# EasyEDA Pro project ProPrj_TPA3156_EASYEDA.epro, board PCB1
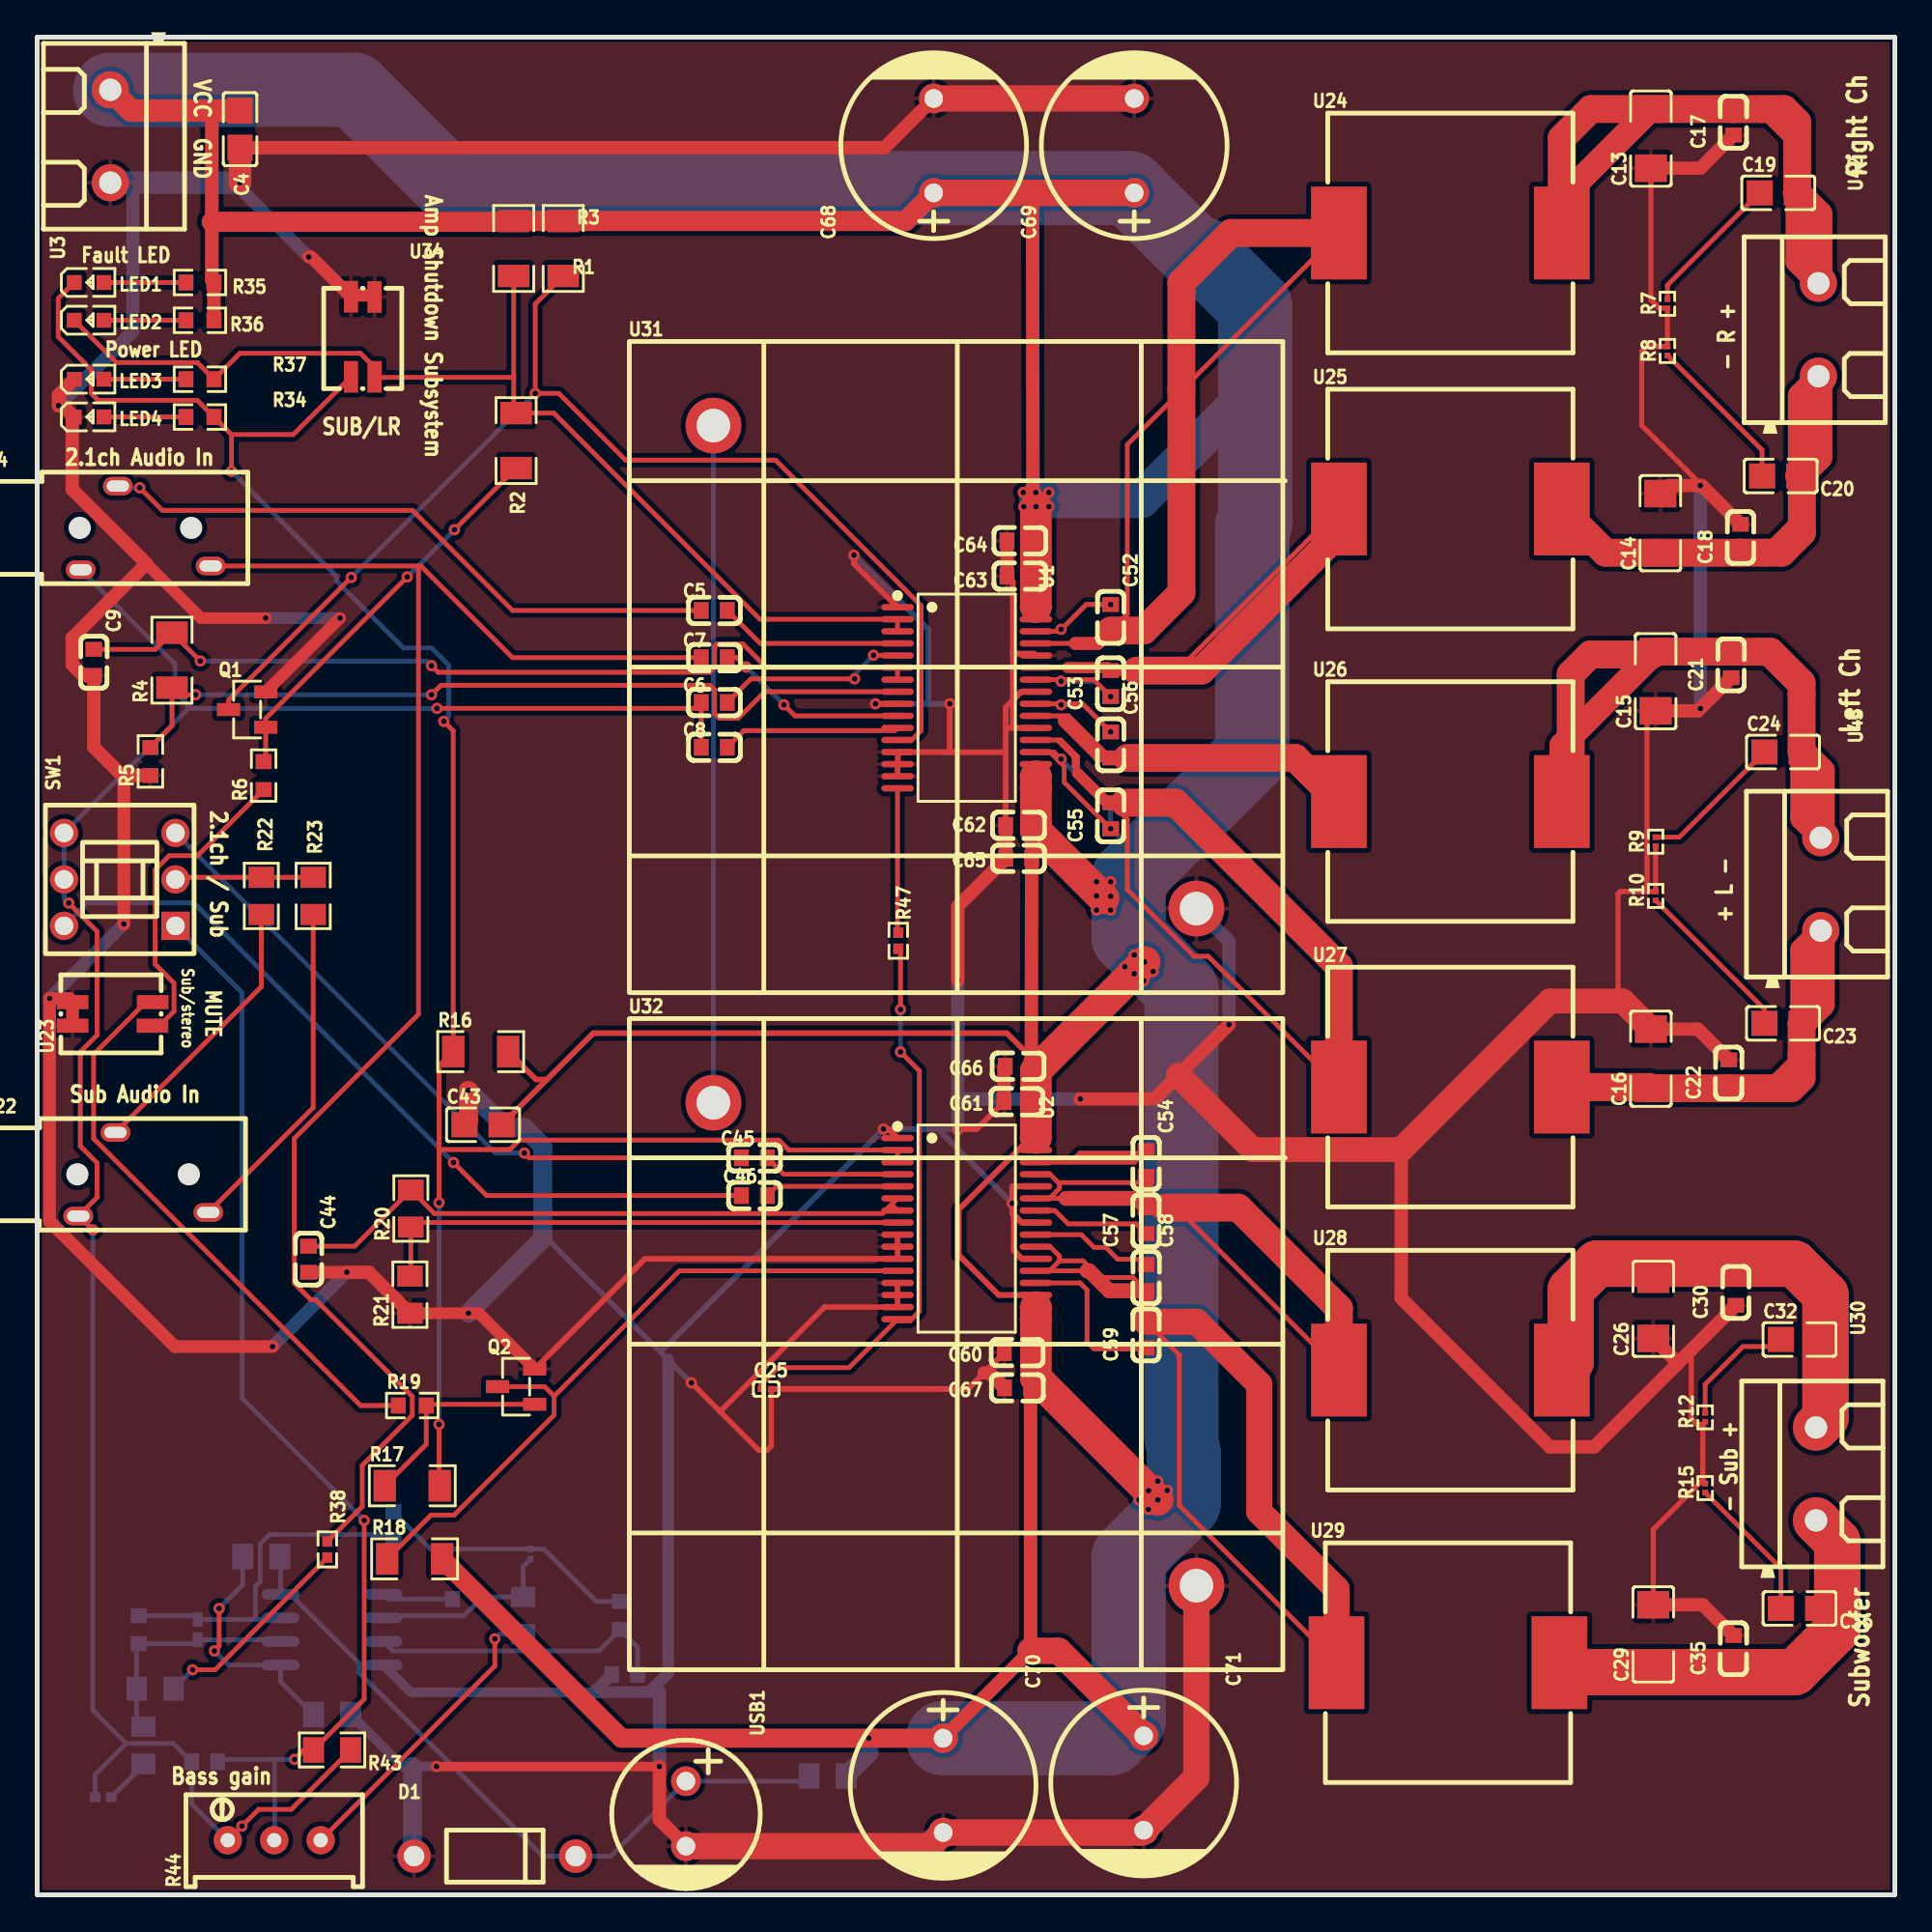
[diagram p1: board, top side]
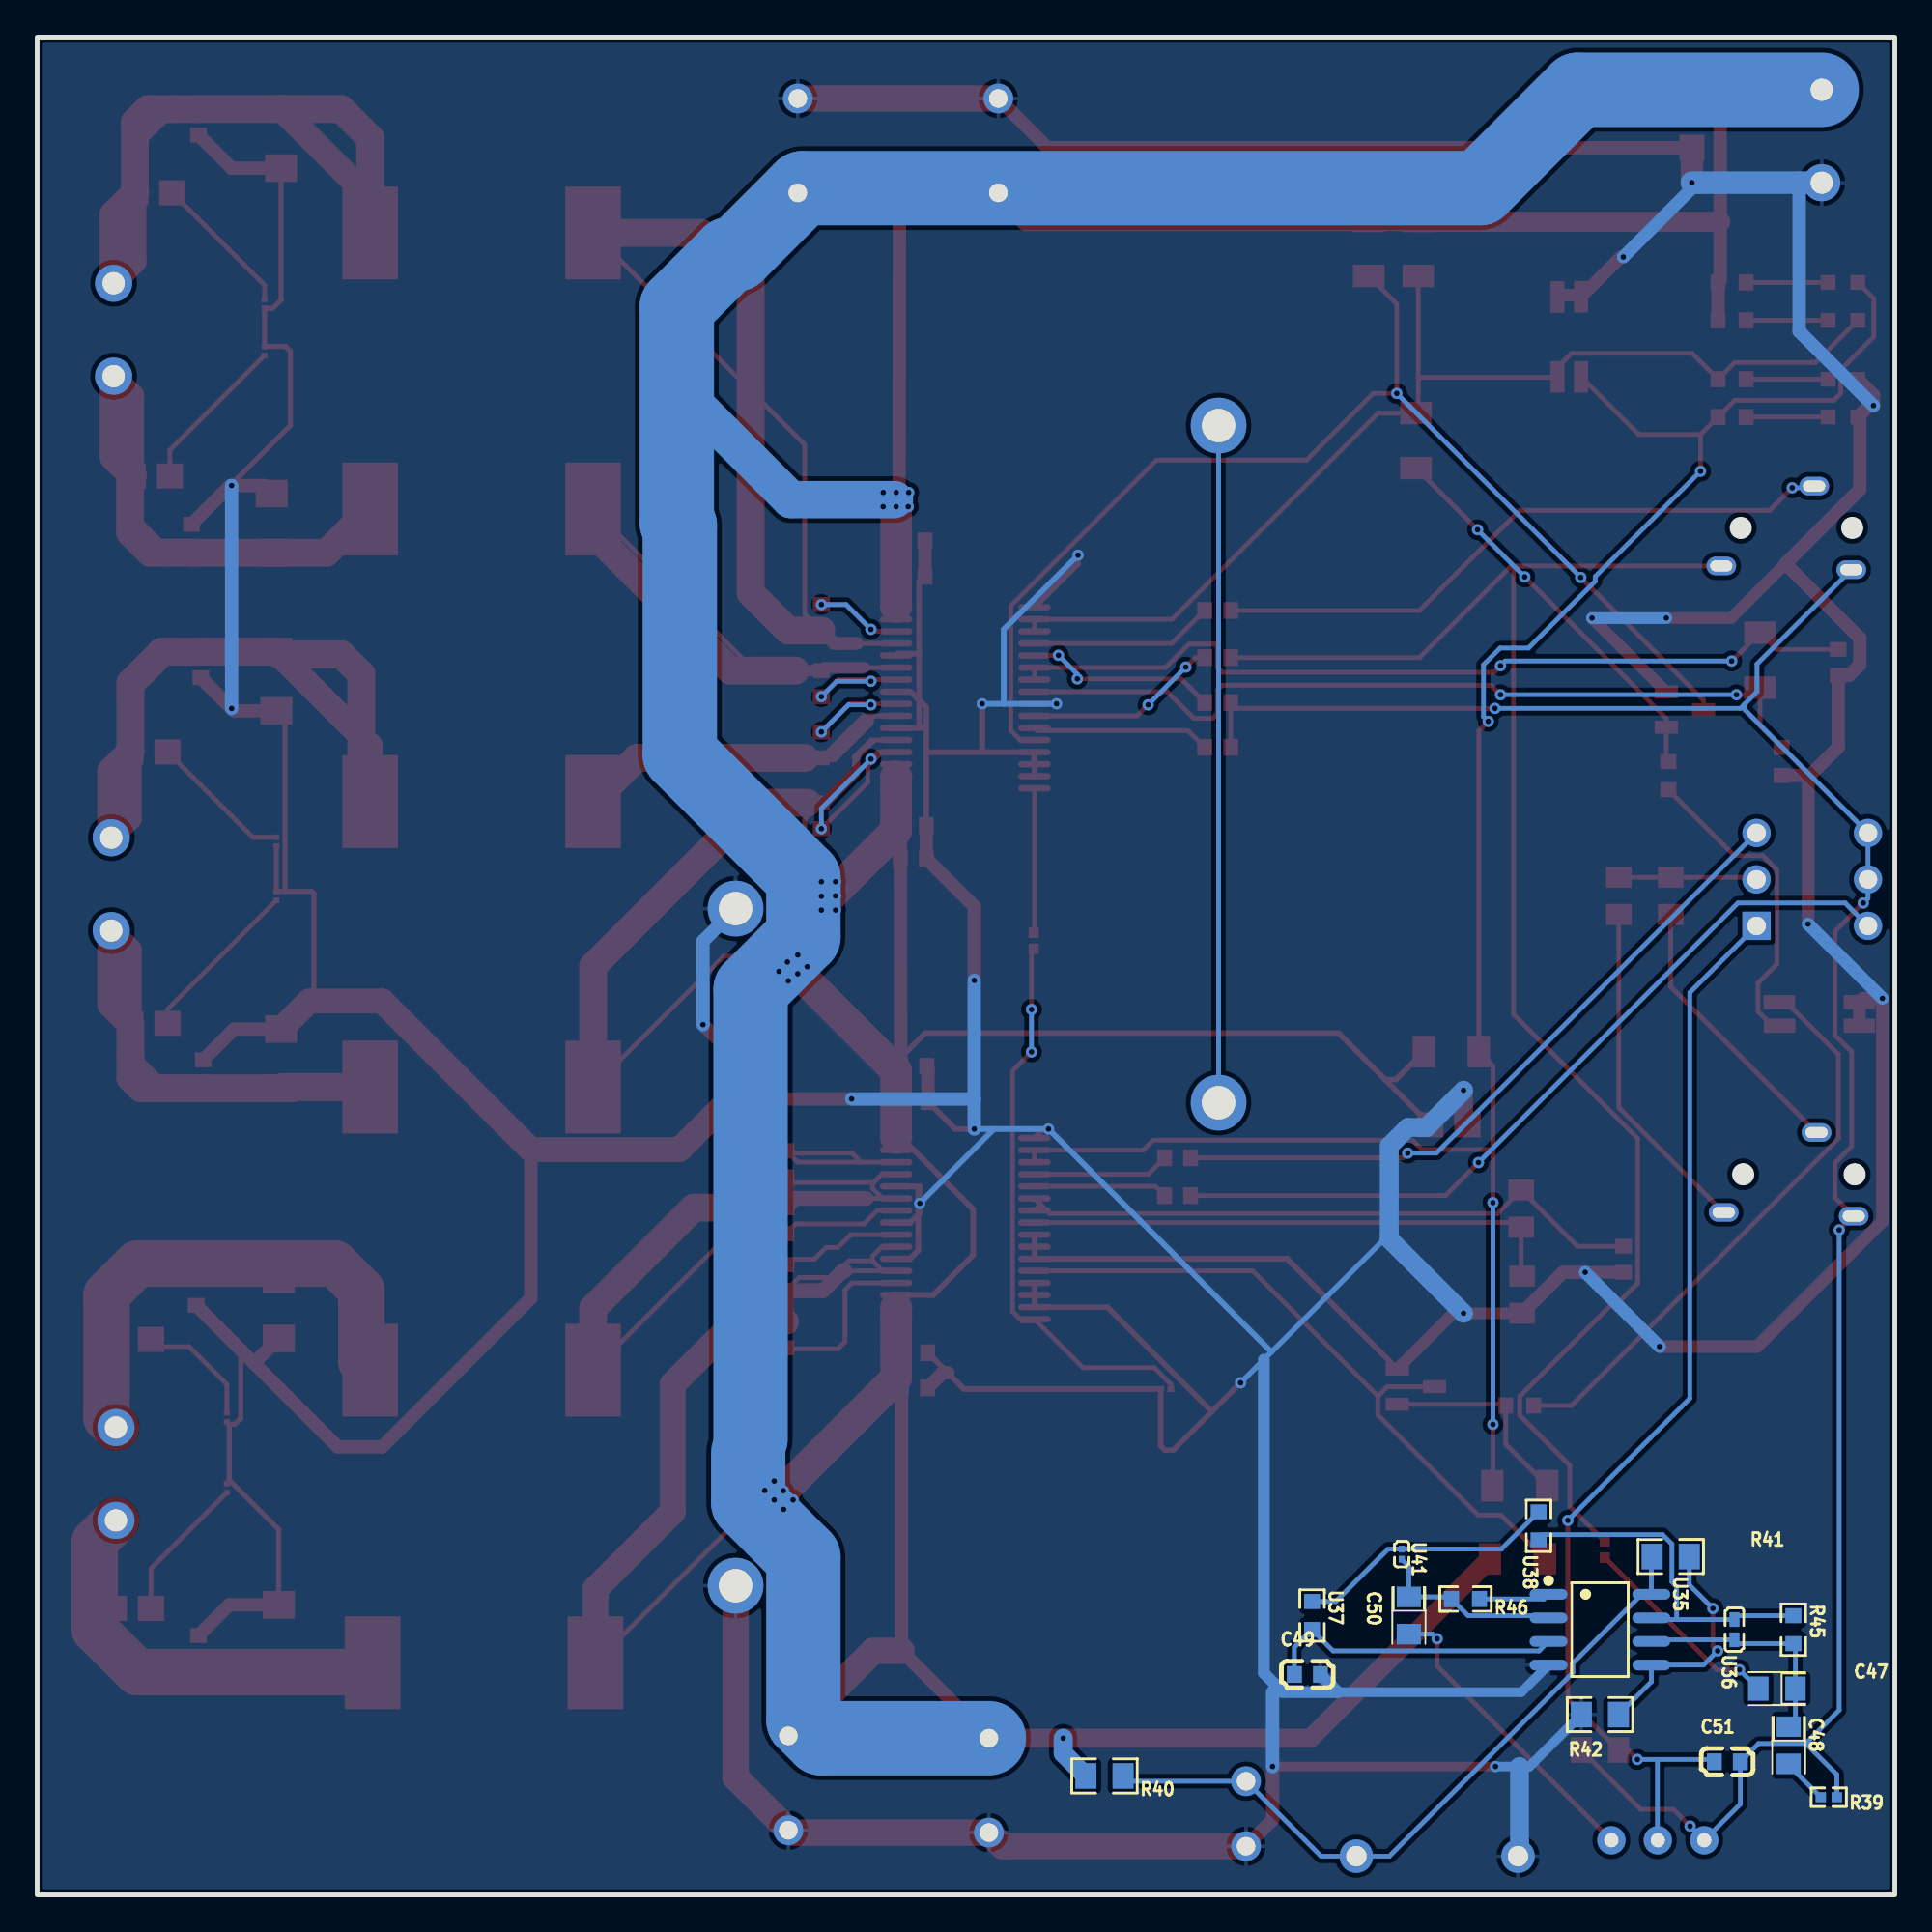
[diagram p2: board, bottom side, seen from below]

Outline 100 x 100 mm; copper layers: Top Layer, Bottom Layer. Coordinates in mm from the lower left corner of the outline.
Outline path: rectangle 0,100 100,0
Stack: Top Layer 0.035mm / Dielectric1 1.51mm FR4 er 4.5 / Bottom Layer 0.035mm

## Design rules (mm)
template: Custom Config
spacing copperThickness1oz (default): track to track 0.102, other pairs 0.152 to 0.3
spacing copperThickness2oz: track to track 0.203, other pairs 0.152 to 0.3
track width copperThickness2oz (default): min 0.203, default 0.254, max 2.54
track width PVCC: min 0.254, default 4, max 5.23
track width Audio_OUT_75W: min 0.4, default 3, max 3.4
track width AUDIO_OUT_140W: min 0.4, default 1.2, max 2.54
differential pair differentialPair (default): width min 0.127, default 0.254, max 2.54; gap min 0.152, default 0.152
via viaSize (default): diameter min 0.5, default 0.61, max 10; hole min 0.3, default 0.305, max 6.3
net PVCC uses PVCC
net GND uses PVCC
net OUT_R+ uses Audio_OUT_75W
net OUT_R- uses Audio_OUT_75W
net OUT_L- uses Audio_OUT_75W
net OUT_L+ uses Audio_OUT_75W
net AUDIO_SUBW+ uses AUDIO_OUT_140W
net AUDIO_SUBW- uses AUDIO_OUT_140W

## Placement (name value [footprint] x y rotation side)
C4  10nF  [C0805]  10.92 95.05 90 top
C5  100nF  [C0603]  36.45 69.14 180 top
C6  100nF  [C0603]  36.45 64.19 180 top
C7  100nF  [C0603]  36.45 66.6 180 top
C8  100nF  [C0603]  36.45 61.77 180 top
C9  1uF  [C0603]  3.05 66.34 270 top
C13  680nF  [C1206]  86.87 94.54 90 top
C14  680nF  [C1206]  87.38 73.84 90 top
C15  680nF  [C1206]  87.12 65.33 90 top
C16  680nF  [C1206]  86.87 45.01 90 top
C17  1nF  [C0603]  91.31 95.43 90 top
C18  1nF  [C0603]  91.69 73.08 90 top
C19  10nF  [C0805]  93.73 91.62 0 top
C20  10nF  [C0805]  93.85 76.38 180 top
C21  1nF  [C0603]  91.19 66.22 90 top
C22  1nF  [C0603]  91.06 44.25 90 top
C23  10nF  [C0805]  93.98 46.91 180 top
C24  10nF  [C0805]  93.98 61.52 0 top
C25  47pF  [C0201]  39.24 27.23 0 top
C26  680nF  [C1206]  87 31.55 90 top
C29  680nF  [C1206]  87 14.02 90 top
C30  1nF  [C0603]  91.44 32.44 90 top
C32  10nF  [C0805]  94.87 29.9 0 top
C35  1nF  [C0603]  91.31 13.26 90 top
C36  10nF  [C0805]  94.87 15.42 180 top
C43  10nF  [C0805]  24 41.45 0 top
C44  1uF  [C0603]  14.61 34.21 270 top
C45  100nF  [C0603]  38.61 39.67 180 top
C46  100nF  [C0603]  38.61 37.64 180 top
C47  10uF  [CAP-SMD_L2.0-W1.3-FD]  6.35 11.1 0 bottom
C48  10uF  [CAP-SMD_L2.0-W1.3-FD]  5.72 8.05 270 bottom
C49  100nF  [C0603]  31.62 11.86 180 bottom
C50  10uF  [CAP-SMD_L2.0-W1.3-FD]  26.16 15.04 270 bottom
C51  100nF  [C0603]  9.02 7.16 180 bottom
C52  220nF  [C0603]  57.78 68.76 270 top
C53  220nF  [C0603]  57.78 65.2 90 top
C54  220nF  [C0603]  59.69 39.36 270 top
C55  220nF  [C0603]  57.78 58.09 90 top
C56  220nF  [C0603]  57.78 61.9 270 top
C57  220nF  [C0603]  59.69 36.29 90 top
C58  220nF  [C0603]  59.69 33.22 270 top
C59  220nF  [C0603]  59.69 30.15 90 top
C60  100nF  [C0603]  52.76 29.19 0 top
C61  100nF  [C0603]  52.75 42.69 0 top
C62  100nF  [C0603]  52.84 57.57 0 top
C63  100nF  [C0603]  52.91 70.98 0 top
C64  1nF  [C0603]  52.91 72.89 0 top
C65  1nF  [C0603]  52.84 55.79 0 top
C66  1nF  [C0603]  52.81 44.6 0 top
C67  1nF  [C0603]  52.77 27.29 0 top
C68  220uF  [CAP-TH_BD10.0-P5.00-D1.0-FD]  48.26 94.16 90 top
C69  220uF  [CAP-TH_BD10.0-P5.00-D1.0-FD]  59.06 94.16 90 top
C70  220uF  [CAP-TH_BD10.0-P5.00-D1.0-FD]  48.77 5.89 270 top
C71  220uF  [CAP-TH_BD10.0-P5.00-D1.0-FD]  59.56 6.02 270 top
D1  1N4742  [DO-41_BD2.4-L4.7-P8.70-D0.8-FD]  24.64 2.08 0 top
LED1  KT-0603R  [LED0603-RD]  2.79 86.79 0 top
LED2  KT-0603R  [LED0603-RD]  2.79 84.76 0 top
LED3  19-213/Y2C-CQ2R2L/3T(CY)  [LED0603-RD-YELLOW]  2.79 81.58 0 top
LED4  19-213/Y2C-CQ2R2L/3T(CY)  [LED0603-RD-YELLOW]  2.79 79.55 0 top
Q1  MMBT2222A 1P  [SOT-23-3_L2.9-W1.3-P1.90-LS2.4-BR]  11.3 63.81 0 top
Q2  MMBT2222A 1P  [SOT-23-3_L2.9-W1.3-P1.90-LS2.4-BR]  25.78 27.36 0 top
R1  100kΩ  [R1206]  25.65 88.63 90 top
R2  100kΩ  [R1206]  25.78 78.28 90 top
R3  100kΩ  [R1206]  28.32 88.63 90 top
R4  100kΩ  [R1206]  7.26 66.46 90 top
R5  20kΩ  [R0603]  6.1 61.01 90 top
R6  1k  [R0603]  12.19 60.25 90 top
R7  3.32Ω  [R0201]  87.76 85.65 90 top
R8  3.32Ω  [R0201]  87.76 83.11 90 top
R9  3.32Ω  [R0201]  87.12 56.69 90 top
R10  3.32Ω  [R0201]  87.12 53.77 90 top
R12  3.32Ω  [R0201]  89.79 25.71 90 top
R15  3.32Ω  [R0201]  89.79 21.9 90 top
R16  100kΩ  [R1206]  23.88 45.39 0 top
R17  100kΩ  [R1206]  20.19 22.02 0 top
R18  100kΩ  [R1206]  20.32 18.09 0 top
R19  1k  [R0603]  20.19 26.34 0 top
R20  47kΩ  [R0805]  20.12 36.94 90 top
R21  75kΩ  [R0805]  20.07 32.31 90 top
R22  220Ω  [R0805]  12.06 53.77 90 top
R23  220Ω  [R0805]  14.86 53.77 90 top
R34  1.1kΩ  [R0603]  8.76 79.55 180 top
R35  1.1kΩ  [R0603]  8.76 86.79 0 top
R36  1.1kΩ  [R0603]  8.76 84.76 0 top
R37  1.1kΩ  [R0603]  8.76 81.58 180 top
R38  15kΩ  [R0402]  15.62 18.59 270 top
R39  15kΩ  [R0402]  3.56 5.26 0 bottom
R40  2kΩ  [R0805]  42.54 6.4 0 bottom
R41  100kΩ  [R0805]  12.06 18.21 0 bottom
R42  100kΩ  [R0805]  15.88 9.7 180 bottom
R43  100kΩ  [R0805]  15.88 7.8 180 top
R44  50kΩ  [RES-ADJ-TH_3P-L9.5-W4.85-P2.50-BL-BS]  12.76 2.94 90 top
R45  47kΩ  [R0603]  5.46 14.28 270 bottom
R46  1k  [R0603]  23.11 15.93 0 bottom
R47  4.7kΩ  [R0402]  46.35 51.36 270 top
SW1  KFC8080-Z  [SW-TH_6P-L8.0-W8.0-P2.50]  4.44 54.66 90 top
U1  TPA3156D2DADR  [HTSSOP-32_L11.0-W6.1-P0.65-LS8.1-BL]  50.04 64.44 270 top
U2  TPA3156D2DADR  [HTSSOP-32_L11.0-W6.1-P0.65-LS8.1-BL]  50.04 35.86 270 top
U3  XY301V-A-5.0-2P  [CONN-TH_XY301V-A-5.0-2P]  3.94 94.67 90 top
U4  HC-PJ-320A-3P-D  [AUDIO-TH_HC-PJ-320A-3P-D]  5.84 73.58 0 top
U22  HC-PJ-320A-3P-D  [AUDIO-TH_HC-PJ-320A-3P-D]  5.72 38.79 0 top
U23  TU-02  [SW-SMD_4P-P1.27-L4.2-W5.4]  4.06 47.42 90 top
U24  10uH  [IND-SMD_L13.2-W12.9_MMD-12FD]  76.07 89.46 0 top
U25  10uH  [IND-SMD_L13.2-W12.9_MMD-12FD]  76.07 74.6 0 top
U26  10uH  [IND-SMD_L13.2-W12.9_MMD-12FD]  76.07 58.85 0 top
U27  10uH  [IND-SMD_L13.2-W12.9_MMD-12FD]  76.07 43.48 0 top
U28  10uH  [IND-SMD_L13.2-W12.9_MMD-12FD]  76.07 28.25 0 top
U29  10uH  [IND-SMD_L13.2-W12.9_MMD-12FD]  75.95 12.5 0 top
U30  SUBWOOFER_CONN  [CONN-TH_XY301V-A-5.0-2P]  95.76 22.66 270 top
U31  XSD188-663  [HEATSINK-SMD_XSD188-663]  49.4 66.09 0 top
U32  XSD188-663  [HEATSINK-SMD_XSD188-663]  49.4 29.64 0 top
U34  TU-02  [SW-SMD_4P-P1.27-L4.2-W5.4]  17.53 83.87 180 top
U35  4558  [SOP-8_L5.0-W4.0-P1.27-LS6.0-BL]  15.88 14.28 270 bottom
U36  33nF  [C0402]  8.64 14.28 90 bottom
U37  10kΩ  [R0603]  31.37 15.04 270 bottom
U38  10kΩ  [R0603]  19.18 19.86 90 bottom
U41  220nF  [C0201]  26.54 18.34 270 bottom
U42  Right Chanel Connector  [CONN-TH_XY301V-A-5.0-2P]  95.88 84.25 270 top
U43  Left Chanel Connector  [CONN-TH_XY301V-A-5.0-2P]  96.01 54.41 270 top
USB1  100uF  [CAP-TH_BD8.0-P3.50-D0.6-FD_1]  34.93 4.37 270 top

## Footprints (pads in the part's own frame, mm; a bottom-side part is the same pattern mirrored in y, then rotated)
AUDIO-TH_HC-PJ-320A-3P-D
  oval 1.6x1 hole 1.2x0.6: 2(-3.5,-2.25) 3(-1.5,2.25) 4(3.5,-2.05)
C0201
  rect 0.368x0.324 smd: 1(-0.275,0) 2(0.275,0)
C0402
  rect 0.79x0.54 smd: 1(-0.545,0) 2(0.545,0)
C0603
  rect 0.8x0.9 smd: 1(-0.7,0) 2(0.7,0)
C0805
  rect 1.41x1.35 smd: 1(-1,0) 2(1,0)
C1206
  rect 1.485x1.728 smd: 1(-1.593,0) 2(1.593,0)
CAP-SMD_L2.0-W1.3-FD
  rect 1.1x1.3 smd: 1(-1,0) 2(1,0)
CAP-TH_BD8.0-P3.50-D0.6-FD_1
  round 1.6 hole 1: 1(-1.75,0) 2(1.75,0)
CAP-TH_BD10.0-P5.00-D1.0-FD
  round 1.6 hole 1: 1(-2.54,0) 2(2.54,0)
CONN-TH_XY301V-A-5.0-2P
  round 2 hole 1.2: 1(-2.5,0) 2(2.5,0)
DO-41_BD2.4-L4.7-P8.70-D0.8-FD
  round 1.8 hole 1.1: 1(-4.35,0) 2(4.35,0)
HEATSINK-SMD_XSD188-663
  round 3 hole 1.8: 1(-13,13) 2(13,-13)
HTSSOP-32_L11.0-W6.1-P0.65-LS8.1-BL
  oval 0.343x1.746 smd: 1(-4.875,-3.724) 2(-4.225,-3.724) 3(-3.575,-3.724) 4(-2.925,-3.724) 5(-2.275,-3.724) 6(-1.625,-3.724) 7(-0.975,-3.724) 8(-0.325,-3.724) 9(0.325,-3.724) 10(0.975,-3.724) 11(1.625,-3.724) 12(2.275,-3.724) 13(2.925,-3.724) 14(3.575,-3.724) 15(4.225,-3.724) 16(4.875,-3.724) 17(4.875,3.724) 18(4.225,3.724) 19(3.575,3.724) 20(2.925,3.724) 21(2.275,3.724) 22(1.625,3.724) 23(0.975,3.724) 24(0.325,3.724) 25(-0.325,3.724) 26(-0.975,3.724) 27(-1.625,3.724) 28(-2.275,3.724) 29(-2.925,3.724) 30(-3.575,3.724) 31(-4.225,3.724) 32(-4.875,3.724)
IND-SMD_L13.2-W12.9_MMD-12FD
  rect 3x5 smd: 1(-6,0) 2(6,0)
LED0603-RD
  rect 0.8x0.8 smd: 1(-0.799,0) 2(0.799,0)
LED0603-RD-YELLOW
  rect 0.8x0.8 smd: 1(-0.799,-0.004) 2(0.799,0.004)
R0201
  rect 0.303x0.324 smd: 1(-0.241,0) 2(0.241,0)
R0402
  rect 0.566x0.54 smd: 1(-0.433,0) 2(0.433,0)
R0603
  rect 0.806x0.864 smd: 1(-0.753,0) 2(0.753,0)
R0805
  rect 1.133x1.377 smd: 1(-1,0) 2(1,0)
R1206
  rect 1.208x1.701 smd: 1(-1.479,0) 2(1.479,0)
RES-ADJ-TH_3P-L9.5-W4.85-P2.50-BL-BS
  round 1.524 hole 0.762: 1(0,2.5) 2(0,0) 3(0,-2.5)
SOP-8_L5.0-W4.0-P1.27-LS6.0-BL
  oval 0.574x2.035 smd: 1(-1.905,-2.768) 2(-0.635,-2.768) 3(0.635,-2.768) 4(1.905,-2.768) 5(1.905,2.768) 6(0.635,2.768) 7(-0.635,2.768) 8(-1.905,2.768)
SOT-23-3_L2.9-W1.3-P1.90-LS2.4-BR
  rect 1.25x0.7 smd: 1(1,-0.95) 2(1,0.95) 3(-1,0)
SW-SMD_4P-P1.27-L4.2-W5.4
  rect 0.76x1.7 smd: 1(-0.635,-2.143) 2(0.635,-2.157) 3(0.635,2.157) 4(-0.635,2.157)
SW-TH_6P-L8.0-W8.0-P2.50
  rect 1.524x1.524 hole 1: 1(-2.5,-3)
  round 1.524 hole 1: 2(0,-3) 3(2.5,-3) 4(-2.5,3) 5(0,3) 6(2.5,3)

## Nets
As in the schematic.

## Via types
v1: diameter 0.61, hole 0.305, Top Layer to Bottom Layer, 89 vias

## Routing (per net, layer and track width the routed paths; a pad name or vN(x,y) marks a point on that pad's centre or on a via; arc(x,y) is an arc through that point)
AGND: length 122.6
  Top Layer w0.254: 35.75,63.87 v1(21.53,63.87) ; 35.75,63.87 35.75,64.19 ; 35.75,63.87 35.75,61.77 ; R43.1 13.68,4.6 11.92,4.6 v1(11.02,3.7) ; 2.23,36.56 3.22,37.54 3.22,39.4 2.33,40.3 2.33,45.38 3.22,46.28 3.22,51.87 v1(1.7,53.39) ; 2.23,36.56 v1(3,35.79) ; 2.23,36.56 U22.2
  Bottom Layer w0.254: 8.09,64.09 8.32,63.87 v1(21.53,63.87) ; 8.09,64.09 7.42,64.77 7.42,66.26 U4.2 ; 8.09,64.09 8.09,63.81 SW1.6 SW1.5 1.44,53.64 v1(1.7,53.39) ; 4.79,8.15 3.12,6.48 3.12,5.26 ; 4.79,8.15 3,9.94 v1(3,35.79) ; 4.79,8.15 7.33,8.15 C51.2 8.32,4.88 R44.1 v1(11.02,3.7)
GND: length 676.6
  Top Layer w0.273: 89.66,22.33 87,19.67 C29.2 ; 89.66,22.33 89.66,25.33 ; 89.66,22.33 89.66,22.27 R15.2 ; R9.1 R10.2 86.66,54.01 ; 89.61,75.86 86.37,79.1 86.37,83.1 86.62,83.35 R8.2 R7.1 87.31,85.41 86.87,85.85 C13.1 ; 89.66,25.33 89.35,25.33 89.04,25.65 89.04,29.33 ; 89.66,25.33 R12.1 ; 86.66,54.01 86.66,63.27 C15.1 ; 86.66,54.01 85.22,54.01 85.1,53.89 85.1,48.12
  Top Layer w0.291: 36.76,26.02 38.84,23.94 39.29,23.94 39.52,24.17 C25.2 ; 36.76,26.02 42.38,31.64 U2.15 ; 36.76,26.02 v1(35.22,27.56)
  Top Layer w0.308: 52.57,36.63 52.49,36.71 v1(52.49,37.22) 52.49,38.14 52.57,38.14 ; 52.57,36.63 52.57,34.69 53.01,34.24 U2.22 ; 52.57,36.63 52.57,38.14 ; 52.57,36.63 53.01,36.19 U2.25 ; v1(45.13,64.11) U1.9 ; 52.52,66.81 53.66,66.81 U1.28 ; 52.52,66.81 52.52,64.31 ; 52.52,66.81 52.52,70.67 C63.1 ; U1.1 43.97,71.66 v1(43.97,72.11) ; C60.1 50.98,28.1 50.1,27.23 C25.2 ; 49.13,61.51 v1(49.13,64.11) ; 49.13,61.51 46.35,61.52 ; 49.13,61.51 52.13,61.51 ; 46.35,61.52 46.32,60.9 ; 46.35,61.52 U1.13 ; 46.32,60.9 U1.15 ; 46.32,60.9 U1.14 ; 52.52,64.31 52.13,63.92 52.13,62.81 ; 52.52,64.31 52.98,64.77 U1.25 ; 52.52,64.31 52.52,62.81 ; v1(49.56,41.22) 50.57,41.22 C61.1 ; U2.1 45.83,41.22 v1(45.56,41.22) ; 52.57,38.14 U2.28 ; 52.13,62.81 52.52,62.81 ; 52.13,62.81 52.13,61.51 ; Q2.2 32.72,34.24 U2.11 U2.10 U2.9 ; 52.52,62.81 U1.22 ; U2.13 U2.14 U2.15 ; 52.13,61.51 C62.1
  Top Layer w0.516: v1(33.5,6.91) v1(21.5,6.91)
  Top Layer w0.63: v1(12.3,68.73) 8.81,68.73 5.89,71.66 ; Q2.2 23.78,31.31 v1(23.22,31.31) R21.1 ; v1(16.3,68.73) Q1.2
  Top Layer w0.684: U34.1 18.06,86.11 16.81,86.11 ; v1(14.62,88.17) 14.75,88.17 16.81,86.11 ; 16.81,86.11 16.89,86.03 ; 4.67,60.26 v1(4.67,52.26) ; v1(12.67,29.51) 7.41,29.51 0.67,36.26 v1(0.67,48.26) 1.71,48.26 U23.3 1.91,46.79 ; v1(16.67,33.51) C44.2
  Top Layer w0.72: C26.1 88.28,28.67 88.28,28.57 ; C13.1 89.53,92.95 C17.1 ; 1.89,79.66 1.89,75.66 5.89,71.66 1.89,67.66 1.89,66.23 2.47,65.64 C9.2 3.05,61.78 4.57,60.26 R5.1 ; 1.89,79.66 1.38,80.17 v1(1.15,80.17) 1.15,80.74 LED3.1 ; 1.89,79.66 LED4.1 ; 73.43,40.12 73.43,32.12 81.43,24.12 83.82,24.12 88.28,28.57 ; C66.1 52.05,44.54 C61.1 ; C22.2 89.4,46.6 C16.2 ; C30.1 88.28,28.57 ; USB1.2 33.5,4.05 v1(33.5,6.91) ; 50.98,28.1 51.26,28.1 C67.1 ; C63.1 C64.1 ; R21.1 17.86,33.51 v1(16.67,33.51) ; v1(56.16,42.84) 60.16,42.84 v1(64.16,46.84) ; C62.1 C65.1 49.56,53.21 v1(49.56,49.22) ; C21.1 89.4,63.74 C15.1 ; 91.31,13.96 89.66,15.61 C29.2 ; C4.1 45.61,94.05 C68.2 ; C14.2 87.81,75.86 v1(89.53,75.86) 89.61,75.86 C18.2
  Top Layer w1.02: C43.1 23.22,41.67 v1(23.22,43.31)
  Top Layer w1.215: C4.1 v1(10.92,92.17)
  Top Layer w1.337: 61.43,44.12 65.43,40.12 73.43,40.12 81.43,48.12 85.35,48.12 C16.2
  Top Layer w1.419: U32.2 62.4,6.32 C71.2 59.44,3.35 C70.2 48.03,2.62 USB1.2 ; C68.2 C69.2
  Bottom Layer w0.291: v1(35.22,27.56) 27.22,35.56
  Bottom Layer w0.308: 47.97,64.11 v1(45.13,64.11) ; 47.97,64.11 47.97,68.11 v1(43.97,72.11) ; 47.97,64.11 v1(49.13,64.11) ; 48.49,41.22 v1(49.56,41.22) ; 48.49,41.22 v1(52.49,37.22) ; 48.49,41.22 v1(45.56,41.22) 33.56,29.22
  Bottom Layer w0.516: 29.97,10.91 20.11,10.91 U35.4 ; R42.1 19.67,6.91 v1(21.5,6.91)
  Bottom Layer w0.63: 33.97,28.81 33.97,11.94 32.94,10.91 29.97,10.91 C49.2 ; v1(12.3,68.73) v1(16.3,68.73)
  Bottom Layer w0.684: 10.62,92.17 v1(14.62,88.17) ; v1(4.67,52.26) v1(0.67,48.26) ; v1(12.67,29.51) v1(16.67,33.51)
  Bottom Layer w0.72: 5.15,92.17 5.15,84.17 v1(1.15,80.17) ; v1(64.16,46.84) 64.16,51.34 U31.2 ; v1(89.53,63.86) v1(89.53,75.86) ; 33.5,10.91 v1(33.5,6.91) ; 49.56,42.84 v1(49.56,49.22) ; 49.56,42.84 v1(49.56,41.22) ; 49.56,42.84 v1(56.16,42.84)
  Bottom Layer w1.02: v1(23.22,43.31) 25.22,41.31 26.22,41.31 27.22,40.31 27.22,35.31 v1(23.22,31.31) ; D1.1 20.2,2.17 20.2,6.91
  Bottom Layer w1.215: v1(10.92,92.17) U3.1
PVCC: length 433.8
  Top Layer w0.3: 27.44,43.89 C43.2 ; 27.44,43.89 26.86,43.89 R16.2 ; 27.44,43.89 29.94,46.39 52.2,46.39 53.45,45.14 C61.2
  Top Layer w0.308: 53.61,40.89 U2.32 U2.31 ; 53.61,40.89 49.61,36.89 49.61,34.44 51.76,32.29 U2.19 U2.18 ; 53.61,40.89 53.45,41.06 53.45,42.39 ; C60.2 53.49,29.21 53.76,29.49 ; U1.31 U1.32 53.61,69.47 C63.2 ; U1.19 U1.18 ; 53.76,57.8 C62.2
  Top Layer w0.72: 53.51,44.63 C66.2 ; 53.51,44.63 53.51,42.76 C61.2 ; 53.51,44.63 C65.2 C62.2 ; 53.49,29.21 C67.2 53.47,13.14 C70.1 ; C63.2 C64.2 53.58,91.62
  Top Layer w0.726: R36.2 R35.2 9.4,86.91 9.4,96.05
  Top Layer w1.02: 21.8,18.09 31.45,8.43 v1(44.77,8.43) C70.1
  Top Layer w1.087: C68.1 46.75,90.1 R3.2 R1.2 25.61,90.06 9.4,90.06 ; 53.45,42.39 C61.2
  Top Layer w1.215: C4.2 5.06,96.05 U3.2
  Top Layer w1.419: C69.1 C68.1 ; 53.47,13.14 54.99,13.14 C71.1
  Top Layer w1.7: 57.4,53.64 53.76,57.29 U1.17 U1.18 ; v1(53.76,74.73) U1.32 ; U2.18 U2.17 53.76,27.82 v1(59.83,21.75) v1(60.32,21.26) ; U2.32 53.76,44.36 v1(59.61,50.22)
  Bottom Layer w1.02: R40.2 44.77,7.62 v1(44.77,8.43)
  Bottom Layer w2: 64.39,80.06 59.44,75.11 53.85,75.11
  Bottom Layer w4: 61.59,24.56 61.59,48.73 58.75,51.58 58.75,54.74 65.41,61.39 65.41,73.71 65.57,73.87 65.57,85.49 62.74,88.32 62.36,88.32 C69.1 58.8,91.87 22.35,91.87 17.06,97.17 U3.2 ; C70.1 57.78,8.43 58.75,9.4 58.75,18.15 61.72,21.13 61.72,23.8
  vias: v1(53.09,75.49) v1(53.11,74.73) v1(53.76,75.49) v1(54.46,75.49) v1(54.46,74.73) v1(57.02,54.53) v1(57.02,53.77) v1(57.02,53.01) v1(57.78,54.53) v1(57.78,53.75) v1(57.78,53.01) v1(58.55,49.96) v1(59.06,50.6) v1(59.06,49.58) v1(59.31,21.26) v1(59.56,49.2) v1(59.82,20.75) v1(60.07,49.71) v1(60.32,22.28) v1(60.83,21.77)
/SD_LR: length 59.6
  Top Layer w0.254: LED2.1 4.27,82.48 8.62,82.48 R37.1 10.92,82.98 17.4,82.98 18.16,82.22 U34.4 18.19,81.69 25.65,81.69 ; 25.65,81.69 25.65,79.89 R2.2 27.81,79.76 38.91,68.67 U1.2 U1.3 ; 25.65,81.69 25.65,87.15
/SD_SUB: length 112
  Top Layer w0.254: v1(21.64,25.32) 21.64,22.06 R17.2 ; 16.89,81.71 13.79,78.61 10.46,78.61 ; 21.64,40.12 21.64,44.63 R16.1 22.4,62.66 v1(21.89,63.17) ; 21.64,40.12 v1(21.64,37.26) ; 21.64,40.12 25.44,40.12 25.95,40.63 39.92,40.63 40.46,40.09 U2.2 U2.3 ; v1(10.46,76.63) 10.46,78.61 ; 10.46,78.61 R34.1 8.62,80.45 3.28,80.45 2.91,80.82 2.91,82.09 1.13,83.87 1.13,85.93 LED1.1
  Bottom Layer w0.254: v1(21.89,63.17) 22.14,63.42 22.14,66.22 21.25,67.12 19.72,67.12 16.13,70.71 16.13,70.96 v1(10.46,76.63) ; v1(21.64,37.26) v1(21.64,25.32)
AUDIO_SUBW+: length 26.9
  Top Layer w2.5: U30.1 96.27,25.66 96.27,32.31 94.6,33.98 83.96,33.98 82.55,32.56 82.55,28.72 U28.2
AUDIO_SUBW-: length 22.5
  Top Layer w2.5: U30.2 96.9,19.01 96.9,14.28 94.62,11.99 82.45,11.99 U29.2
IN_N_SUB: length 43.5
  Top Layer w0.254: C46.2 24.19,37.64 v1(22.41,39.42)
  Bottom Layer w0.254: SW1.4 2.67,53.39 8.44,53.39 v1(22.41,39.42)
IN_P_LEFT: length 88.4
  Top Layer w0.254: 35.75,66.6 25.59,66.6 20.65,71.53 20.53,71.53 ; 20.53,71.53 20.53,47.4 13.84,40.72 13.84,32.93 14.74,32.03 15,32.03 20.19,26.83 20.19,25.81 17.5,23.12 17.5,20.9 R38.1 ; 20.53,71.53 U4.4
IN_P_RIGHT: length 34.2
  Top Layer w0.254: 35.75,69.14 25.59,69.14 20.2,74.53 6.74,74.53 v1(5.52,75.74)
  Bottom Layer w0.254: U4.3 4.43,75.74 v1(5.52,75.74)
IN_P_SUB: length 37.7
  Top Layer w0.254: C45.2 26.48,39.67 v1(26.22,39.93)
  Bottom Layer w0.254: SW1.3 24.68,39.93 v1(26.22,39.93)
MUTE_L/R: length 17.1
  Top Layer w0.254: R6.1 8.64,55.94 7.11,55.94 6.35,55.18 6.35,50.1 7.37,49.08 7.37,47.56 6.6,46.79 6.21,46.79
MUTE_SUB: length 31.2
  Top Layer w0.254: U23.2 6.1,47.94 5.73,47.94 3.04,45.25 3.04,40.71 17.41,26.34 R19.1
OUT_L+: length 36.6
  Top Layer w0.72: 94.98,45.23 93.3,43.55 C22.1 90.93,43.42
  Top Layer w1.215: U43.2 94.98,50.88 C23.1
  Top Layer w1.337: C16.1 82.14,43.42 U27.2
  Top Layer w1.5: U43.2 96.01,47.95 C23.1 94.98,43.98 94.42,43.42 91.06,43.42 91.06,43.42 C16.1 86.8,43.48 U27.2
OUT_L-: length 51.7
  Top Layer w0.72: 92.69,66.92 94.98,64.62 ; C15.2 C21.2
  Top Layer w1.215: C24.2 94.98,57.94 U43.1
  Top Layer w1.337: 86.97,66.77 82.07,61.87 U26.2
  Top Layer w1.5: U26.2 82.55,59.33 82.55,65.71 83.61,66.77 86.97,66.77 C15.2 91.18,66.92 C21.2 93.31,66.92 94.98,65.25 C24.2 96.01,60.49 U43.1
OUT_R+: length 49.8
  Top Layer w0.72: C13.2 C17.2 ; C19.2 94.73,94.22 92.81,96.13
  Top Layer w1.215: C19.2 94.73,87.91 U42.1
  Top Layer w1.337: C13.2 82.07,91.34
  Top Layer w1.5: U42.1 95.88,90.46 C19.2 94.74,91.63 94.74,95.43 94.04,96.13 C17.2 91.31,96.13 C13.2 83.63,96.13 82.07,94.57 U24.2
OUT_R-: length 35.5
  Top Layer w0.72: 91.69,72.25 93.06,72.25 94.85,74.03 C20.1 ; 91.56,72.25 C18.1
  Top Layer w1.215: C20.1 94.85,80.72 U42.2
  Top Layer w1.5: U25.2 84.43,72.25 C14.1 91.69,72.25 91.69,72.25 93.91,72.25 95,73.33 95,76.23 C20.1 95.88,77.41 U42.2
SUB_CONN_2.1_LOW_PASS: length 59.5
  Top Layer w0.254: v1(17.61,20.16) 17.61,10.53 R43.2 14.37,7.8 v1(13.86,7.29)
  Bottom Layer w0.254: v1(13.86,7.29) 12.78,7.29 ; 12.78,7.29 9.84,7.29 C51.1 ; 12.78,7.29 12.78,2.96 R44.2 ; v1(17.61,20.16) 11.04,26.72 11.04,48.57 SW1.1
SUB_CONN_SEP: length 7.5
  Top Layer w0.254: SW1.2 7.56,54.77 R22.2 R23.2
$1N1782: length 64.5
  Top Layer w0.254: 28.32,87.15 26.81,85.64 v1(26.81,80.82) 28.08,80.82 31.68,77.23 39.75,77.23 47.58,69.39 47.58,62.67 47.08,62.17 U1.12 ; Q1.3 10.3,64.31 v1(16.91,70.92)
  Bottom Layer w0.254: v1(16.91,70.92) v1(26.81,80.82)
$1N2014: length 21.4
  Top Layer w0.254: v1(19.92,70.95) 12.3,63.33 Q1.1 12.3,61.11 R6.2 ; v1(22.46,73.49) R2.1
  Bottom Layer w0.254: v1(19.92,70.95) v1(22.46,73.49)
$1N2219: length 9.9
  Top Layer w0.254: C5.1 38.92,67.36 U1.4
$1N2228: length 10.4
  Top Layer w0.254: v1(44.01,65.46) 38.42,65.46 C6.1 ; U1.5 46.3,66.73 v1(45.02,66.73)
  Bottom Layer w0.254: v1(45.02,66.73) 44.01,65.71 v1(44.01,65.46)
$1N2235: length 10.5
  Top Layer w0.254: U1.10 40.79,63.47 v1(40.2,64.06) ; C7.1 37.66,66.6 v1(38.16,66.09)
  Bottom Layer w0.254: v1(38.16,66.09) v1(40.2,64.06)
$1N2241: length 9.6
  Top Layer w0.254: U1.11 46.17,62.67 38.05,62.67 C8.1
$1N2940: length 45
  Top Layer w0.254: v1(21.23,64.6) 21.74,65.11 36.21,65.11 36.47,64.86 36.47,63.59 36.72,63.33 37.74,63.33 39.17,64.77 U1.8 ; R4.1 7.26,64.6 ; 7.26,64.6 v1(8.53,64.6) ; 7.26,64.6 7.26,62.93 R5.2
  Bottom Layer w0.254: v1(8.53,64.6) v1(21.23,64.6)
$1N2981: length 47
  Top Layer w0.254: v1(21.23,66.16) 21.58,65.81 36.21,65.81 36.47,66.06 36.47,67.19 36.61,67.33 37.99,67.33 39.26,66.06 U1.6 46.31,65.42 ; C9.1 6.36,67.05 R4.2 v1(8.78,66.42)
  Bottom Layer w0.254: v1(8.78,66.42) 20.97,66.42 v1(21.23,66.16)
$1N3797: length 8
  Top Layer w0.254: 55.01,68.02 v1(55.12,68.12) ; 55.01,68.02 U1.30 ; 55.01,68.02 55.03,68.02 56.47,69.46 v1(57.78,69.46)
  Bottom Layer w0.254: v1(57.78,69.46) 56.45,69.46 v1(55.12,68.12)
$1N3803: length 61.7
  Top Layer w0.254: C52.2 58.68,68.96 58.68,78.07 U24.1 ; U1.29 55.88,67.36
  Top Layer w0.7: 55.88,67.36 57.09,67.36 C52.2
  Top Layer w1.5: C52.2 59.56,68.06 61.59,70.09 61.59,86.79 64.26,89.46 U24.1
$1N3963: length 8
  Top Layer w0.254: v1(57.78,62.6) 56.27,64.11 55.06,64.11 ; 55.06,64.11 v1(55.12,64.06) ; 55.06,64.11 U1.24
  Bottom Layer w0.254: v1(55.12,64.06) 56.33,64.06 v1(57.78,62.6)
$1N3967: length 22
  Top Layer w0.254: 54.95,63.47 55.52,63.47 C56.2 ; 54.95,63.47 U1.23 ; 54.95,63.47 55.25,63.17
  Top Layer w0.6: 55.25,63.17 57.15,61.27 57.78,61.27 57.78,61.27 ; C56.2 58.67,61.2
  Top Layer w1.5: U26.1 67.72,61.2 58.67,61.2
$1N3975: length 11.8
  Top Layer w0.254: 54.52,61.52 54.74,61.52 v1(55.12,61.14) ; 54.52,61.52 U1.20 ; 54.52,61.52 55.29,60.75 55.29,59.89 v1(57.78,57.39)
  Bottom Layer w0.254: v1(55.12,61.14) 57.78,58.47 v1(57.78,57.39)
$1N3982: length 53.8
  Top Layer w0.254: U27.1 63.04,50.52 62.28,50.52 58.68,54.11 58.68,57.89 C55.2 56.01,60.57 ; 56.01,60.57 56.01,60.38 ; 56.01,60.57 56.01,61.27 55.11,62.17 54.92,62.17 ; 56.01,60.57 55.82,60.76 55.82,61.27 54.92,62.17 ; 54.92,62.17 U1.21
  Top Layer w0.6: 56.01,60.38 57.59,58.79 C55.2 58.55,58.79
  Top Layer w1.5: 58.55,58.79 61.28,58.79 70.07,49.99 U27.1
$1N4001: length 7.5
  Top Layer w0.254: 55.03,65.42 v1(55.12,65.33) ; 55.03,65.42 56.87,65.42 v1(57.78,64.5) ; 55.03,65.42 53.76,65.42
  Bottom Layer w0.254: v1(55.12,65.33) 56.96,65.33 v1(57.78,64.5)
$1N4006: length 33
  Top Layer w0.254: U1.27 55.47,66.06 ; 61.38,65.9 U25.1
  Top Layer w0.6: 59.18,65.9 C53.2 57.62,66.06 55.47,66.06
  Top Layer w1.5: U25.1 70.07,73.3 62.68,65.9 59.18,65.9
$1N4665: length 7.8
  Top Layer w0.254: R7.2 87.76,86.65 C19.1
$1N4702: length 8.6
  Top Layer w0.254: R8.1 92.85,77.77 C20.2
$1N4989: length 9
  Top Layer w0.254: C23.2 92.98,47.67 R10.1
$1N5053: length 7.8
  Top Layer w0.254: R9.2 88.4,56.93 C24.1
$1N6437: length 7.8
  Top Layer w0.254: U1.16 46.31,51.83 R47.1
$1N6442: length 30.5
  Top Layer w0.254: 46.22,30.9 U2.16 ; 46.22,30.9 43.71,28.38 39.87,28.38 38.97,27.48 C25.1 ; 46.22,30.9 46.98,30.9 47.49,31.4 47.49,44.36 v1(46.47,45.37) ; v1(46.47,47.66) 46.47,50.81 R47.2
  Bottom Layer w0.254: v1(46.47,45.37) v1(46.47,47.66)
$1N7467: length 7.9
  Top Layer w0.254: C36.2 93.87,17.57 R15.1
$1N8160: length 10.3
  Top Layer w0.254: 59.56,39.93 59.07,39.44 55.65,39.44 ; 59.56,39.93 C54.1 ; 59.56,39.93 56.13,39.93 55.65,39.44 ; U2.30 55.65,39.44
$1N8164: length 6.4
  Top Layer w0.254: C57.1 59.17,36.12 55.5,36.12 54.78,36.84 U2.26
$1N8169: length 6.6
  Top Layer w0.254: C58.1 59.4,34.21 58.17,34.21 57.53,34.85 56.9,34.85 56.21,35.54 U2.24
$1N8174: length 9.1
  Top Layer w0.254: C59.1 59.63,29.39 56.9,29.39 56.51,29.77 56.51,32.56 56.14,32.94 U2.20
$1N8240: length 45.1
  Top Layer w0.254: U2.29 54.52,38.79 54.97,38.34 ; 54.49,37.49 55.37,37.49 ; 54.49,37.49 55.03,38.03 55.03,38.28 54.97,38.34 ; 54.49,37.49 U2.27 ; 59.69,37.01 61.3,37.01 U28.1 ; 54.97,38.34 59.37,38.34 C54.2
  Top Layer w0.8: C57.2 C54.2 ; C57.2 60.71,36.99 ; C57.2 59.2,37.49 55.37,37.49
  Top Layer w1.5: U28.1 70.07,31.58 64.66,36.99 60.71,36.99
$1N8252: length 62.7
  Top Layer w0.254: U2.23 54.52,34.89 55.03,34.38 55.03,34.13 ; U29.1 61.49,20.95 61.49,29.05 C59.2 ; C58.2 58.98,33.23 57.2,33.23 56.3,34.13 55.03,34.13 ; 55.03,34.13 54.49,33.59 ; 54.49,33.59 56.51,33.59 ; 54.49,33.59 U2.21
  Top Layer w0.8: C59.2 C58.2 57.7,32.52 56.63,33.59 56.51,33.59
  Top Layer w1.4: C59.2 62.42,30.85 65.79,27.48 65.79,20.62 69.95,16.47 U29.1
$1N11098: length 37.7
  Top Layer w0.254: 27.83,26.85 34.57,33.59 U2.12 ; 27.83,26.85 27.83,25.83 22.44,20.44 21.2,20.44 R18.1 ; 27.83,26.85 27.32,27.36 Q2.3
$1N11099: length 11.1
  Top Layer w0.254: Q2.1 21.01,26.41 R19.2 20.95,24.25 R17.1
$1N11392: length 34.3
  Top Layer w0.254: 46.04,37.21 U2.6 ; 46.04,37.21 46.04,37.12 U2.7 ; 46.04,37.21 45.5,36.67 21.39,36.67 R20.2 17.09,34.91 C44.1
$1N11394: length 29
  Top Layer w0.254: R21.2 20.12,33.36 R20.1 20.36,36.19 U2.8
$1N11527: length 7.4
  Top Layer w0.254: U2.4 40.19,38.79 C45.1
$1N11533: length 7.2
  Top Layer w0.254: U2.5 39.81,38.14 C46.1
$1N12103: length 15
  Top Layer w0.254: U22.3 12.06,48.89 R22.1
$1N12107: length 18.4
  Top Layer w0.254: U22.4 14.86,42.38 R23.1
$1N17569: length 36.4
  Bottom Layer w0.254: U31.1 U32.1
$1N22357: length 7.5
  Top Layer w0.254: 93.36,29.51 93.74,29.51 94.12,29.9 ; 93.36,29.51 91.82,29.51 89.79,27.48 R12.2 ; 93.36,29.51 93.74,29.9 C32.1
$1N36466: length 4.4
  Top Layer w0.254: LED4.2 8.01,79.56
$1N36468: length 4.4
  Top Layer w0.254: LED1.2 R35.1
$1N36477: length 4.4
  Top Layer w0.254: LED2.2 R36.1
$1N36525: length 4.4
  Top Layer w0.254: LED3.2 8.01,81.59
$1N39804: length 11.2
  Top Layer w0.254: R38.2 9.58,12.12 v1(8.37,12.12)
  Bottom Layer w0.254: C47.2 v1(8.37,12.12)
$1N39840: length 2.5
  Bottom Layer w0.254: C48.2 5.72,6.98 R39.2
$1N40769: length 38.4
  Bottom Layer w0.254: R41.2 13.11,18.17 U35.8 13.23,16.06 13.74,16.06 17.33,12.47 17.33,11.96 27.21,2.08 D1.2 30.89,2.08 USB1.1 41.26,6.12 R40.1
$1N40894: length 16.2
  Bottom Layer w0.254: 31.38,14.27 30.24,13.13 19.15,13.13 U35.3 ; 31.38,14.27 U37.2 ; 31.38,14.27 32.32,13.33 32.32,11.86
$1N40897: length 14.2
  Bottom Layer w0.254: U38.2 21.18,18.61 U41.1 27.28,18.61 30.1,15.79 U37.1
$1N40933: length 10.2
  Bottom Layer w0.254: U41.2 26.16,17.68 C50.1 23.98,16.04 R46.2 22.97,15.03 18.76,15.03 U35.2
$1N41118: length 3.8
  Bottom Layer w0.254: U35.1 18.9,15.93 R46.1
$1N41167: length 16.4
  Top Layer w0.254: R44.3 24.64,12.32 v1(24.64,13.78)
  Bottom Layer w0.254: C50.2 24.89,14.04 v1(24.64,13.78)
$1N41301: length 13
  Top Layer w0.254: v1(9.8,15.42) 9.8,13.39 v1(9.54,13.13)
  Bottom Layer w0.254: v1(9.8,15.42) 11.06,16.69 R41.1 ; R42.2 13.11,11.47 U35.5 10.3,12.37 v1(9.54,13.13)
$1N41306: length 12.4
  Bottom Layer w0.254: C48.1 5.35,9.42 C47.1 5.35,13.41 R45.2 8.43,13.52 U36.1 13.02,13.73 U35.6
$1N41351: length 19.4
  Bottom Layer w0.254: 11.75,14.82 11.75,16.6 12,16.85 12,18.88 12.51,19.39 18.89,19.39 U38.1 ; 11.75,14.82 U36.2 8.43,15.03 R45.1 ; 11.75,14.82 13.02,14.82 U35.7

## Copper pours and planes (outline as drawn; the poured copper is in the pictures)
GND on Top Layer: 0,100 100,100 100,0 0,0
GND on Bottom Layer: 0,100 100,100 100,0 0,0

## Text on the board
Top Silkscreen Layer: Sub/stereo | Fault LED | Power LED | MUTE | 2.1ch Audio In | Sub Audio In | Bass gain | SUB/LR | + L - | - R + | - Sub + | VCC  GND | 2.1ch / Sub | Amp Shutdown Subsystem | Left Ch | Right Ch | Subwoofer
